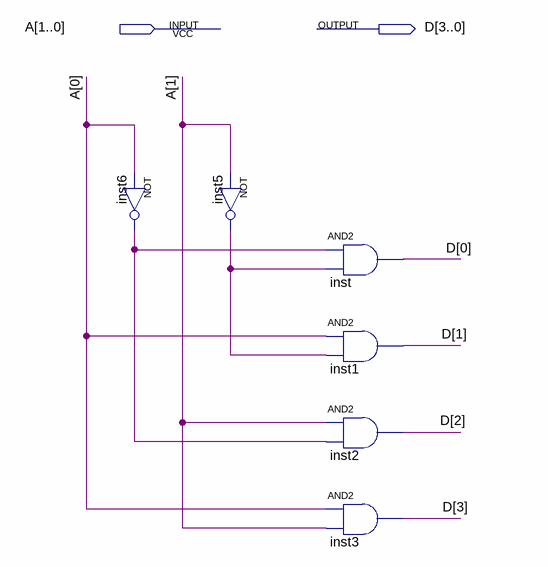
[diagram p0: schematic sheet]
// Quartus schematic DECODER_2_4.bdf as structural Verilog: 6 symbols, 2 pins
module DECODER_2_4 (
  input  [1:0] A,
  output [3:0] D
);

  wire inst5_out, inst6_out;

  not inst6 (inst6_out, A[0]);
  not inst5 (inst5_out, A[1]);
  and inst (D[0], inst6_out, inst5_out);
  and inst1 (D[1], A[0], inst5_out);
  and inst2 (D[2], A[1], inst6_out);
  and inst3 (D[3], A[0], A[1]);
endmodule
